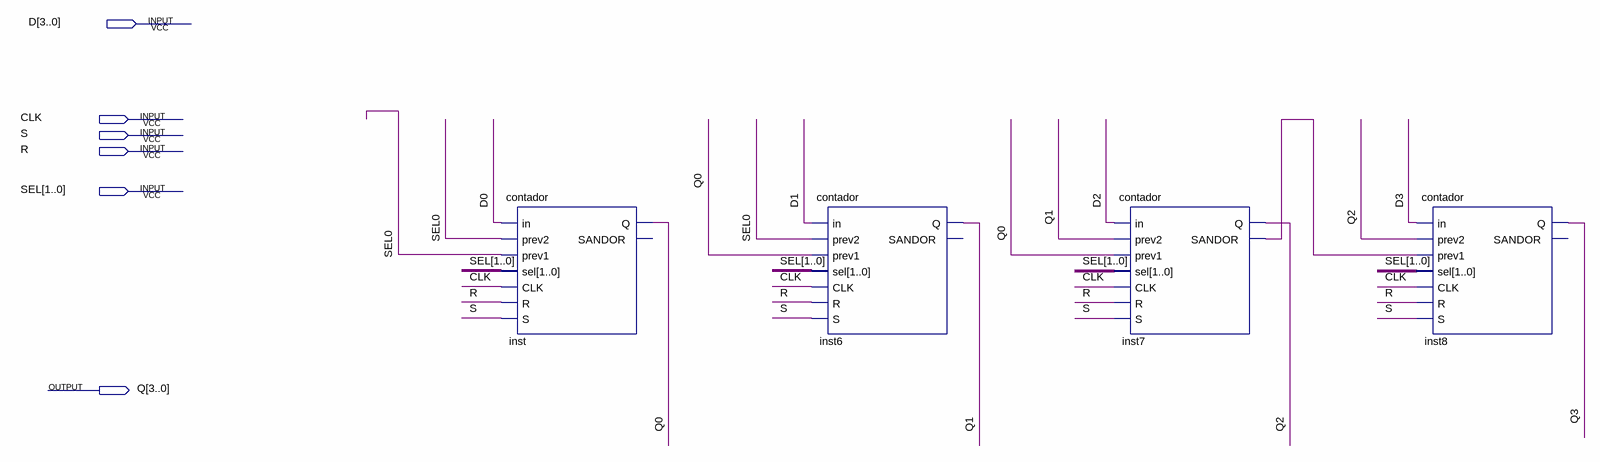
[diagram p0: schematic sheet]
// Quartus schematic contador4bits.bdf as structural Verilog: 4 symbols, 6 pins
module contador4bits (
  input  [3:0] D,
  input  CLK,
  input  S,
  input  R,
  input  [1:0] SEL,
  output [3:0] Q
);

  wire inst7_sandor;

  contador inst (
    .in(D[0]), .prev2(SEL[0]), .prev1(SEL[0]), .sel(SEL), .CLK(CLK), .R(R), .S(S), .Q(Q[0]));  // open: SANDOR
  contador inst6 (
    .in(D[1]), .prev2(SEL[0]), .prev1(Q[0]), .sel(SEL), .CLK(CLK), .R(R), .S(S), .Q(Q[1]));  // open: SANDOR
  contador inst7 (
    .in(D[2]), .prev2(Q[1]), .prev1(Q[0]), .sel(SEL), .CLK(CLK), .R(R), .S(S), .Q(Q[2]), .SANDOR(inst7_sandor));
  contador inst8 (
    .in(D[3]), .prev2(Q[2]), .prev1(inst7_sandor), .sel(SEL), .CLK(CLK), .R(R), .S(S), .Q(Q[3]));  // open: SANDOR
endmodule
